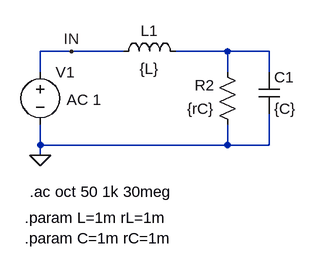
[diagram p0: schematic ls(cpr).asc]
ls(cpr).asc, the LTspice schematic file:
Version 4
SHEET 1 880 680
WIRE -96 96 -144 96
WIRE -16 96 -96 96
WIRE 144 96 64 96
WIRE 208 96 144 96
WIRE -144 128 -144 96
WIRE 144 128 144 96
WIRE 208 128 208 96
WIRE -144 240 -144 208
WIRE 144 240 144 208
WIRE 144 240 -144 240
WIRE 208 240 208 192
WIRE 208 240 144 240
WIRE -144 256 -144 240
FLAG -144 256 0
FLAG -96 96 IN
SYMBOL voltage -144 112 R0
WINDOW 123 41 58 Left 2
WINDOW 39 0 0 Left 2
SYMATTR Value2 AC 1
SYMATTR InstName V1
SYMATTR Value ""
SYMBOL cap 192 128 R0
SYMATTR InstName C1
SYMATTR Value {C}
SYMBOL res 160 224 R180
WINDOW 0 36 76 Left 2
WINDOW 3 36 40 Left 2
SYMATTR InstName R2
SYMATTR Value {rC}
SYMBOL ind -32 112 R270
WINDOW 0 32 56 VTop 2
WINDOW 3 5 56 VBottom 2
SYMATTR InstName L1
SYMATTR Value {L}
SYMATTR SpiceLine Rser=0
TEXT -160 312 Left 2 !.ac oct 50 1k 30meg
TEXT -168 352 Left 2 !.param L=1m rL=1m\n.param C=1m rC=1m

The netlist it stands for:
* ls(cpr).asc
V1 IN 0 AC 1
C1 N001 0 {C}
R2 0 N001 {rC}
L1 IN N001 {L} Rser=0
.ac oct 50 1k 30meg
.param L=1m rL=1m
.param C=1m rC=1m
.backanno
.end